# Altium schematic sheet Esquematico.SchDoc
size A4
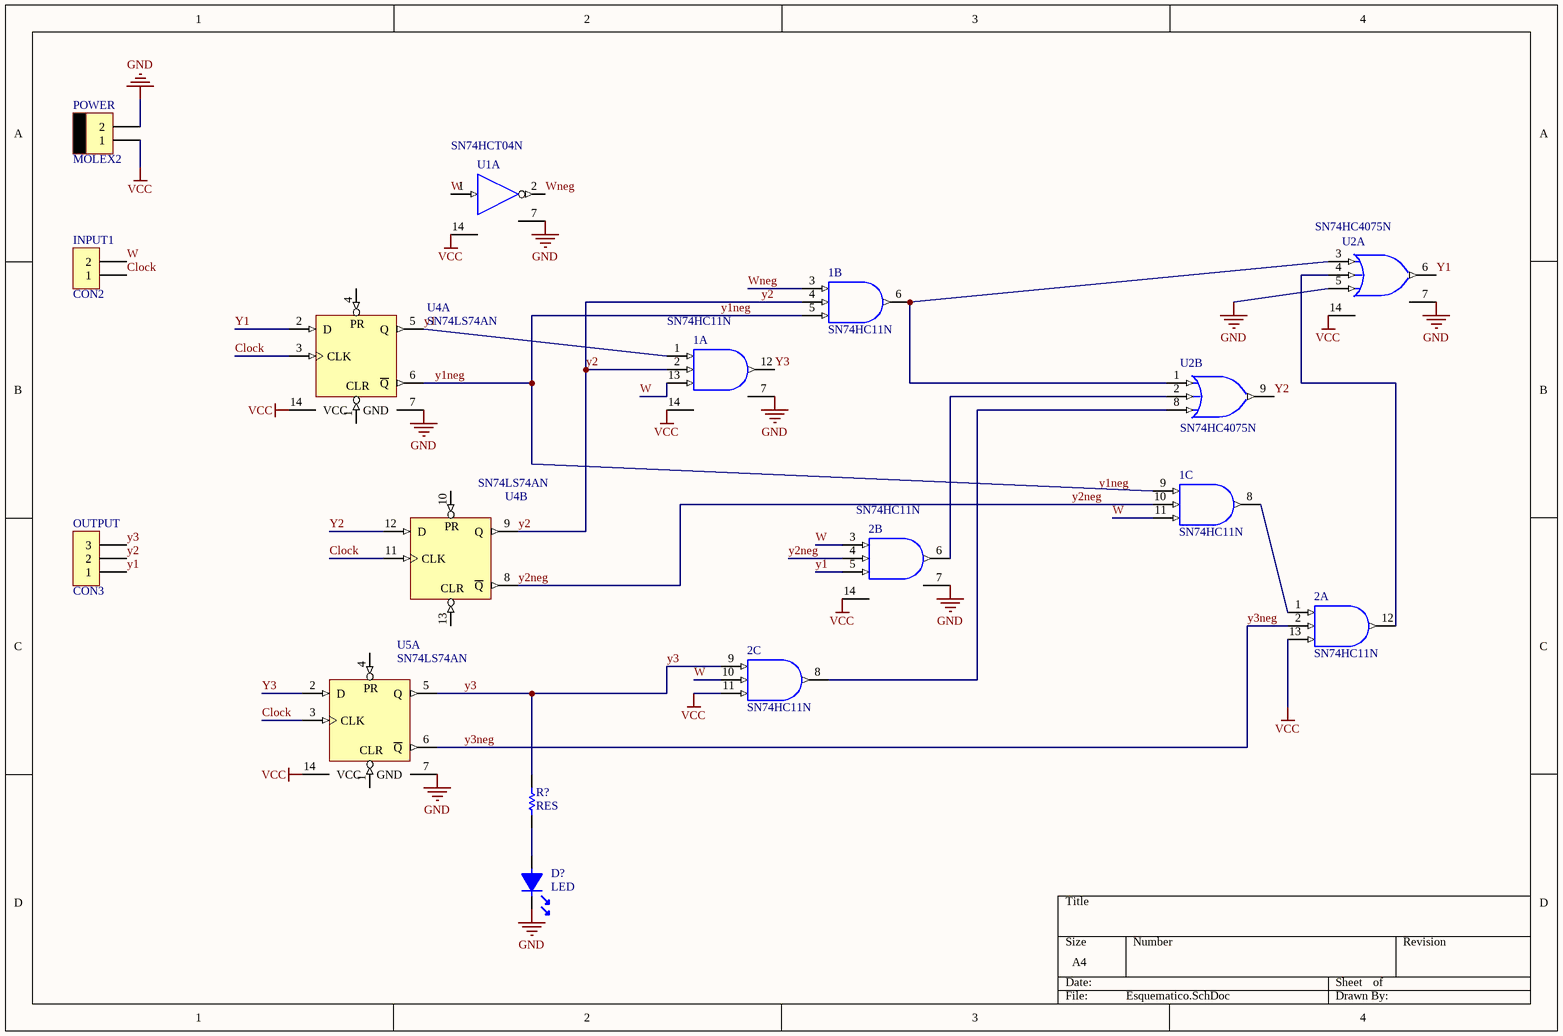
[diagram p0: Esquematico.SchDoc]

## Parts
1  SN74HC11N  [N014]  (parts A,B,C of 3)
2  SN74HC11N  [N014]  (parts A,B,C of 3)
D?  LED  [LED3]
INPUT1  CON2  [SIP2]
OUTPUT  CON3  [SIP3]
POWER  MOLEX2  [MOLEX2]
R?  RES  [RES400]
U1  SN74HCT04N  [N014]  (part A of 6)
U2  SN74HC4075N  [N014]  (parts A,B of 3)
U4  SN74LS74AN  [N014D]  (parts A,B of 2)
U5  SN74LS74AN  [N014D]  (part A of 2)

## Nets
GND: 1.7(GND) 2.7(GND) D?.2 POWER.2 U1.7(GND) U2.5(C) U2.7(GND) U4.7(GND) U5.7(GND)
VCC: 1.14(VCC) 2.11(C) 2.13(C) 2.14(VCC) POWER.1 U1.14(VCC) U2.14(VCC) U4.14(VCC) U5.14(VCC)
Clock: INPUT1.1 U4.3(CLK) U4.11(CLK) U5.3(CLK)
W: 1.11(C) 1.13(C) 2.3(A) 2.10(B) INPUT1.2 U1.1(A)
Wneg: 1.3(A) U1.2(Y)
y1: 1.1(A) 2.5(C) OUTPUT.1 U2.6(Y) U4.2(D) U4.5(Q)
y1neg: 1.5(C) 1.9(A) U4.6(~{Q})
y2: 1.2(B) 1.4(B) OUTPUT.2 U2.9(Y) U4.9(Q) U4.12(D)
y2neg: 1.10(B) 2.4(B) U4.8(~{Q})
Y3: 1.12(Y) 2.9(A) OUTPUT.3 R?.2 U5.2(D) U5.5(Q)
y3neg: 2.2(B) U5.6(~{Q})
Net1_6: 1.6(Y) U2.1(A) U2.3(A)
Net1_8: 1.8(Y) 2.1(A)
Net2_6: 2.6(Y) U2.2(B)
Net2_8: 2.8(Y) U2.8(C)
Net2_12: 2.12(Y) U2.4(B)
NetD?_1: D?.1 R?.1

Not connected (* = marked no-connect by the designer): U4 1(CLR) 4(PR) 10(PR) 13(CLR); U5 1(CLR) 4(PR)

## Notes on the sheet
- Labels drawn without touching a wire or pin: y1neg

## Library data of the parts
1 2 = SN74HC11N: Triple 3-Input Positive-AND Gate; Published: 8-Jun-2000; LatestRevisionDate: 04-Mar-2005; LatestRevisionNote: Stylized 3D Model Added.; DatasheetVersion: May-1997; PackageVersion: Oct-1995; PackageReference: N014; Publisher: Altium Limited; PackageDescription: DIP; 14 Leads; Row Spacing 7.62 mm; Pitch 2.54 mm; ComponentLink1Description: Manufacturer Link; ComponentLink1URL: http://www.ti.com/; ComponentLink2Description: Datasheet; ComponentLink2URL: http://www-s.ti.com/sc/ds/SN74HC11.pdf
U1 = SN74HCT04N: Hex Inverter; Published: 8-Jun-2000; LatestRevisionDate: 04-Mar-2005; LatestRevisionNote: Stylized 3D Model Added.; DatasheetVersion: May-1997; PackageVersion: Oct-1995; PackageReference: N014; Publisher: Altium Limited; PackageDescription: DIP; 14 Leads; Row Spacing 7.62 mm; Pitch 2.54 mm; ComponentLink1Description: Manufacturer Link; ComponentLink1URL: http://www.ti.com/; ComponentLink2Description: Datasheet; ComponentLink2URL: http://www-s.ti.com/sc/ds/SN54HCT04.pdf
U2 = SN74HC4075N: Triple 3-Input Positive-OR Gate; Published: 8-Jun-2000; LatestRevisionDate: 04-Mar-2005; LatestRevisionNote: Stylized 3D Model Added.; DatasheetVersion: Sep-1987; PackageVersion: Oct-1995; PackageReference: N014; Publisher: Altium Limited; PackageDescription: DIP; 14 Leads; Row Spacing 7.62 mm; Pitch 2.54 mm; ComponentLink1Description: Manufacturer Link; ComponentLink1URL: http://www.ti.com/; ComponentLink2Description: Datasheet; ComponentLink2URL: http://www-s.ti.com/sc/ds/sn74hc4075.pdf
U4 U5 = SN74LS74AN: Dual D-Type Positive-Edge-Triggered Flip-Flop with Preset and Clear; Published: 8-Jun-2000; LatestRevisionDate: 04-Mar-2005; LatestRevisionNote: Stylized 3D Model Added.; DatasheetVersion: Mar-1988; PackageVersion: Oct-1995; PackageReference: N014D; Publisher: Altium Limited; PackageDescription: DIP; 14 Leads; Row Spacing 7.62 mm; Pitch 2.54 mm; ComponentLink1Description: Manufacturer Link; ComponentLink1URL: http://www.ti.com/; ComponentLink2Description: Datasheet; ComponentLink2URL: http://www-s.ti.com/sc/ds/sn74ls74a.pdf